# Altium schematic sheet Crystal.SchDoc
size A; SheetNumber: 8; SheetTotal: 10
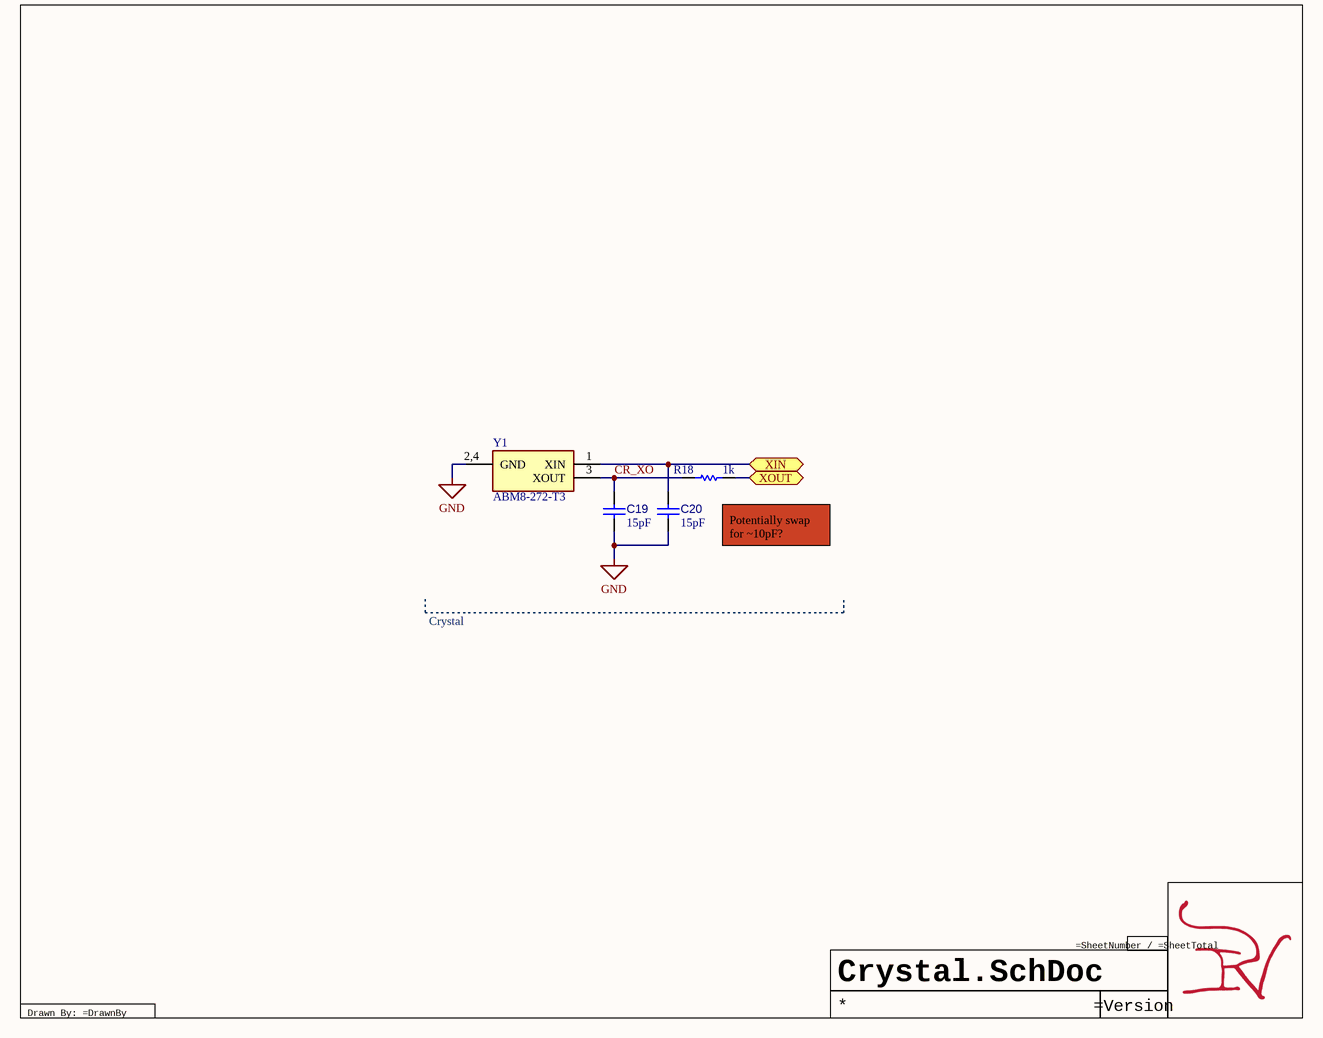
[diagram p0: Crystal.SchDoc]

## Parts
C19  value 15pF  [CAP 0201_0603]  (hidden comment: GRM0335C1H150JA01D)
C20  value 15pF  [CAP 0201_0603]  (hidden comment: GRM0335C1H150JA01D)
R18  value 1k  [RES 0201_0603]  (hidden comment: 1k-0201-0.05/1)
Y1  ABM8-272-T3  [ABM8272T3 - Reduced]

## Ports
XIN (bidir, see 2040Macro-PCB[3B], RP2040[1B]), XOUT (bidir, see 2040Macro-PCB[3B], RP2040[1B])

## Nets
GND: C19.1 C20.1 Y1.2,4(GND)
CR_XO: C19.2 R18.2 Y1.3(XOUT)
XIN: C20.2 Y1.1(XIN) ; port XIN
XOUT: R18.1 ; port XOUT

## Notes on the sheet
- (near R18) Potentially swap for ~10pF?
- Crystal
- Drawn By: =DrawnBy

## Library data of the parts
C19 C20 = CMP-001-00040-1: Ceramic Capacitor, Multilayer, Ceramic, 50V, 5% +Tol, 5% -Tol, C0G, 30ppm/Cel TC, 0.000015uF, Surface Mount, 0201; Multilayer: Yes; Tolerance  (fill in as +-): 5%; JESD-609 Code: e3; Mounting Technology: Surface Mount; Reach SVHC Compliant: Yes; Width: 0.3mm; Rated DC Voltage (URdc): 50V; Length: 0.6mm; Termination: Wraparound; Temperature Characteristics Code: C0G; Case/Package: 0201; Pins: 2; Package Shape: Rectangular; Min Operating Temperature: -55°C; Package Style: SMTMeter; Capacitor Type: Ceramic; Terminal Finish: Nickel; Height: 0.3mm; Dielectric Material: Ceramic; Max Operating Temperature: 125°C; RoHS Compliant: Yes; Tolerance (fill in as +-): 5%; Packaging: Tape and Reel
R18 = CMP-009-00051-1: Fixed Resistor, Metal Glaze/thick Film, 0.05W, 1000ohm, 25V, 1% +/-Tol, 200ppm/Cel, Surface Mount, 0201; Power: 50mW; Package Height: 0.23mm; Package Width: 0.3mm; Reference Standard: AEC-Q200; Package Length: 0.6mm; Rated Temperature: 70°C; Temperature Coefficient: 200ppm/°C; Package Shape: Rectangular; Package Style: SMTMeter; Resistor Type: FIXED RESISTOR; Technology: METAL GLAZE/THICK FILM; Case/Package: 0201; RoHS Compliant: Yes; Termination: Wraparound; Terminal Finish: Nickel; Max Operating Temperature: 125°C; Reach SVHC Compliant: Yes; Packaging: Tape and Reel; Tolerance: 1%; Min Operating Temperature: -55°C; Pins: 2; Working Voltage: 25V; Mounting Technology: Surface Mount; JESD-609 Code: e3; Construction: Rectangular
Y1 = CMP-003-00000-3: Crystal, 12MHZ, 10PF, 3.2MM X 2.5MM Rohs Compliant: Yes; Manufacturer_Name: ABRACON; Mouser Price/Stock: https://www.mouser.co.uk/ProductDetail/ABRACON/ABM8-272-T3?qs=QpmGXVUTftEj6miOiJBMxQ%3D%3D; Design Item ID: ABM8-272-T3; Mouser Part Number: 815-ABM8-272-T3; Height: 0.8mm; Datasheet Link: https://abracon.com/datasheets/ABM8-272-T3.pdf; Manufacturer_Part_Number: ABM8-272-T3; Source: SamacSys.SchLib